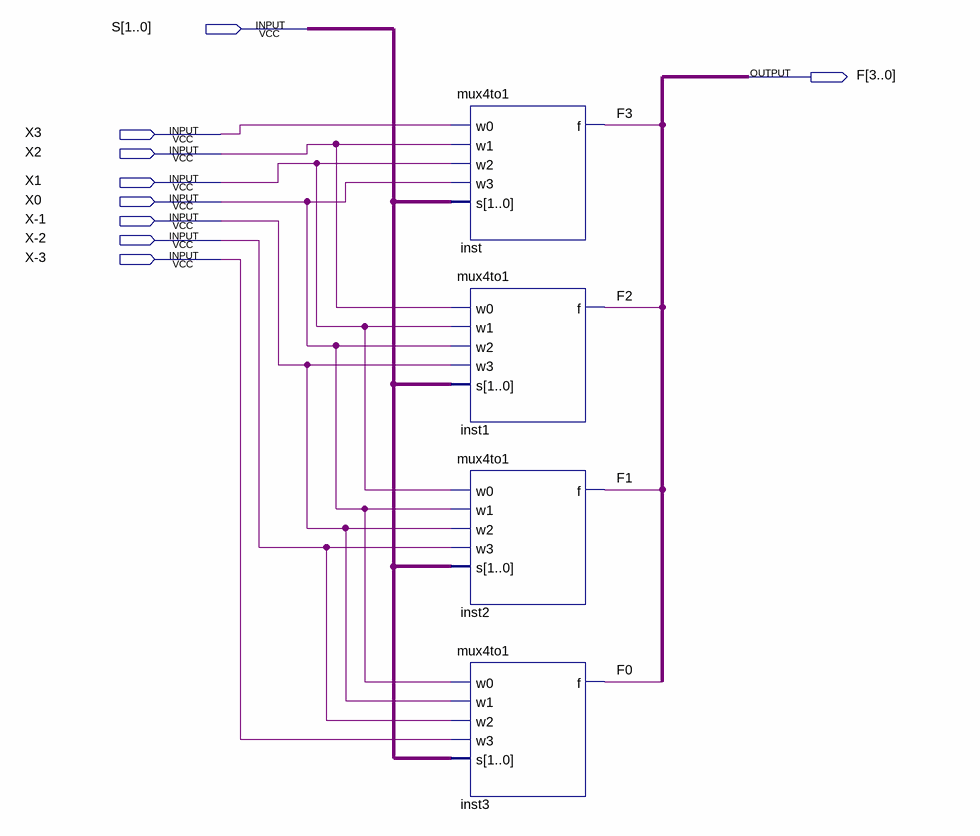
[diagram p0: schematic sheet]
// Quartus schematic lab8step2.bdf as structural Verilog: 4 symbols, 9 pins
module lab8step2 (
  input  [1:0] S,
  input  X3,
  input  X2,
  input  X1,
  input  X0,
  input  \X-1 ,
  input  \X-2 ,
  input  \X-3 ,
  output [3:0] F
);

  mux4to1 inst (.w0(X3), .w1(X2), .w2(X1), .w3(X0), .s(S), .f(F[3]));
  mux4to1 inst1 (.w0(X2), .w1(X1), .w2(X0), .w3(\X-1 ), .s(S), .f(F[2]));
  mux4to1 inst2 (.w0(X1), .w1(X0), .w2(\X-1 ), .w3(\X-2 ), .s(S), .f(F[1]));
  mux4to1 inst3 (.w0(X0), .w1(\X-1 ), .w2(\X-2 ), .w3(\X-3 ), .s(S), .f(F[0]));
endmodule
